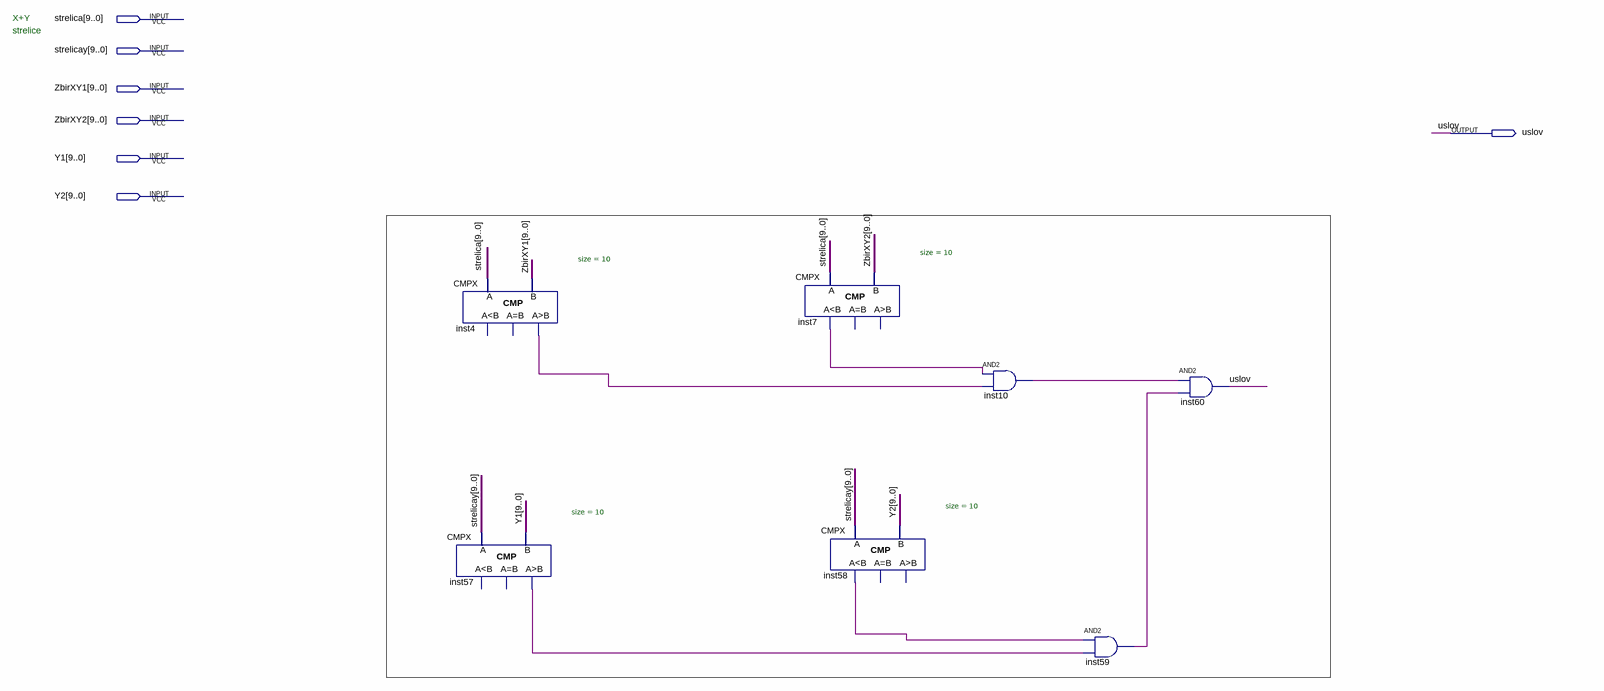
[diagram p0: schematic sheet]
// Quartus schematic UslovPolja.bdf as structural Verilog: 7 symbols, 7 pins
module UslovPolja (
  input  [9:0] strelica,
  input  [9:0] strelicay,
  input  [9:0] ZbirXY1,
  input  [9:0] ZbirXY2,
  input  [9:0] Y1,
  input  [9:0] Y2,
  output uslov
);

  wire inst4_gr, inst7_ls, inst10_out, inst57_gr, inst58_ls, inst59_out;

  CMPX #(.size(10)) inst57 (.A(strelicay), .B(Y1), .gr(inst57_gr));  // open: ls, eq
  CMPX #(.size(10)) inst4 (.A(strelica), .B(ZbirXY1), .gr(inst4_gr));  // open: ls, eq
  CMPX #(.size(10)) inst7 (.A(strelica), .B(ZbirXY2), .ls(inst7_ls));  // open: eq, gr
  CMPX #(.size(10)) inst58 (.A(strelicay), .B(Y2), .ls(inst58_ls));  // open: eq, gr
  and inst10 (inst10_out, inst7_ls, inst4_gr);
  and inst59 (inst59_out, inst58_ls, inst57_gr);
  and inst60 (uslov, inst10_out, inst59_out);

  // Notes on the sheet:
  //   X+Y 
  //   strelice
endmodule
